# Altium schematic sheet dwm.SchDoc
size A4; Scale: 1:1; DocumentType: Схема электрическая принципиальная; FirstReferrence: АБВГ.123456.001
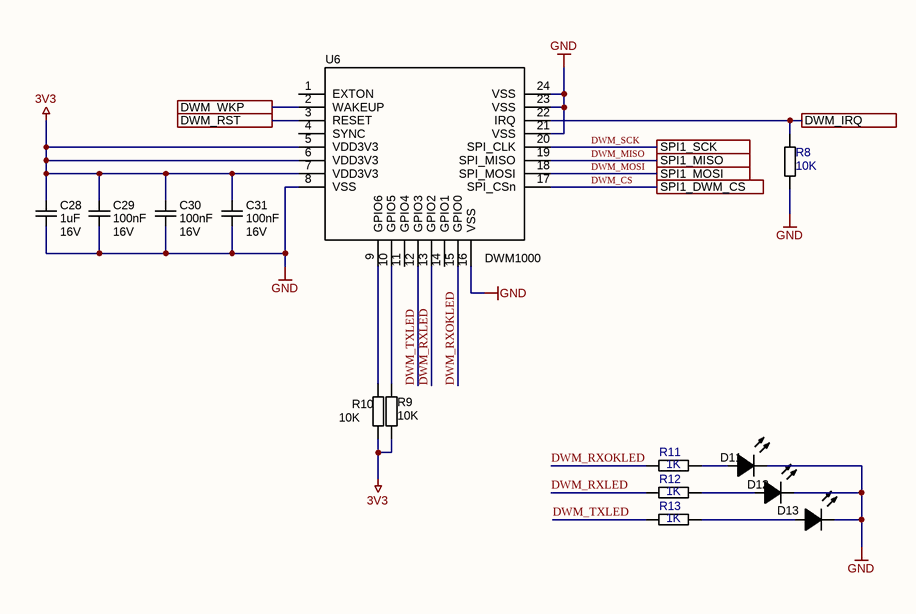
[diagram p0: dwm.SchDoc]

## Parts
C28  value 1uF  Voltage: 16V  [C0603]  (hidden comment: C0603)
C29  value 100nF  Voltage: 16V  [C0603]  (hidden comment: C0603)
C30  value 100nF  Voltage: 16V  [C0603]  (hidden comment: C0603)
C31  value 100nF  Voltage: 16V  [C0603]  (hidden comment: C0603)
D11  LED0805  [LED0805]  (value not drawn)
D12  LED0805  [LED0805]  (value not drawn)
D13  LED0805  [LED0805]  (value not drawn)
R8  10K  [SMD0603]
R9  value 10K  [SMD0603]  (hidden comment: R0603)
R10  value 10K  [SMD0603]  (hidden comment: R0603)
R11  1K  [SMD0603]
R12  1K  [SMD0603]
R13  1K  [SMD0603]
U6  DWM1000  [DWM1000]

## Ports
DWM_IRQ, DWM_RST, DWM_WKP, SPI1_DWM_CS, SPI1_MISO, SPI1_MOSI, SPI1_SCK

## Nets
3V3: C28.1 C29.1 C30.1 C31.1 R9.2 R10.2 U6.5(VDD3V3) U6.6(VDD3V3) U6.7(VDD3V3)
GND: C28.2 C29.2 C30.2 C31.2 D11.1(K) D12.1(K) D13.1(K) R8.1 U6.8(VSS) U6.16(VSS) U6.21(VSS) U6.23(VSS) U6.24(VSS)
DWM_CS: U6.17(SPI_CSn) ; port SPI1_DWM_CS
DWM_IRQ: R8.2 U6.22(IRQ) ; port DWM_IRQ
DWM_MISO: U6.19(SPI_MISO) ; port SPI1_MISO
DWM_MOSI: U6.18(SPI_MOSI) ; port SPI1_MOSI
DWM_RST: U6.3(RESET) ; port DWM_RST
DWM_RXLED: R12.2 U6.13(GPIO2)
DWM_RXOKLED: R11.2 U6.15(GPIO0)
DWM_SCK: U6.20(SPI_CLK) ; port SPI1_SCK
DWM_TXLED: R13.2 U6.12(GPIO3)
DWM_WKP: U6.2(WAKEUP) ; port DWM_WKP
NetD11_2: D11.2(A) R11.1
NetD12_2: D12.2(A) R12.1
NetD13_2: D13.2(A) R13.1
NetR9_1: R9.1 U6.10(GPIO5)
NetR10_1: R10.1 U6.9(GPIO6)

Not connected (* = marked no-connect by the designer): U6 1(EXTON) 4(SYNC) 11(GPIO4) 14(GPIO1)

## Notes on the sheet
- Title
- Size:
- Date:
- A4
- Number:
- Time:
- Revision:
- Sheet
- of
- File:

## Library data of the parts
D11-D13 = LED0805: LED SMD 0805 K1A2
R8 = R0603: Value: 1K
R11-R13 = R0603: Value: 1K
U6 = DWM1000: MOD IEEE802.15.4-2011 UWB TXRX; Manufacturer: Decawave Limited; Frequency: 3.5GHz ~ 6.5GHz; Data Rate: 6.8Mbps; Serial Interfaces: SPI; Antenna Type: Integrated, Chip; Voltage - Supply: 2.8 V ~ 3.6 V; Current - Receiving: 64mA; Current - Transmitting: 31mA; Supplier 1: Digi-Key; Manufacturer Part Number: DWM1000; RoHS: RoHS Compliant; Category: RF/IF and RFID; Stock 1: 1028; Pricing 1: 1=32.16, 10=26.704, 100=24.24, 250=22.51296 (USD); Packaging: Cut Tape (CT); RF Family/Standard: 802.15.4; Protocol: -; Modulation: -; Power - Output: -; Sensitivity: -; Memory Size: -; Mounting Type: Surface Mount; Operating Temperature: -40°C ~ 85°C; Package / Case: Module; ComponentLink1URL: http://www.decawave.com/sites/default/files/product-pdf/dwm1000-product-brief.pdf; ComponentLink1Description: http://www.decawave.com/sites/default/files/product-pdf/dwm1000-product-brief.pdf; Supplier Part Number 1: 1479-1002-1-ND
C28-C31 = C0603: Model: *